# EAGLE design leitorEncoder (EAGLE 6.6.0)
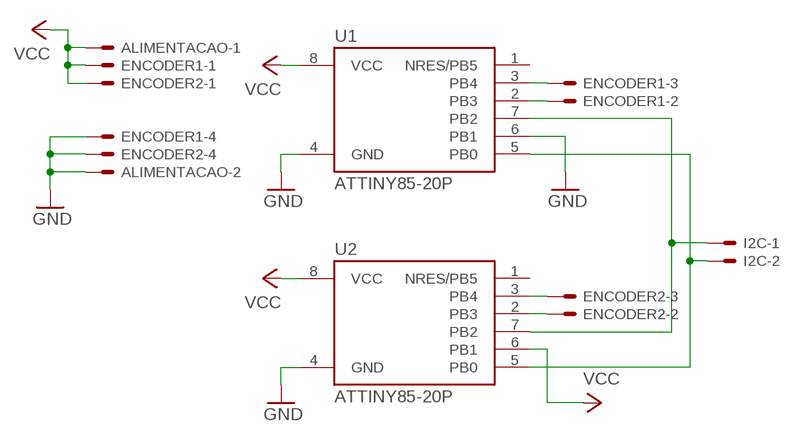
[diagram p0: schematic, sheet 1]

## Parts
ALIMENTACAO  CONN_0227-2021  [6410-02]
ENCODER1  CONN_0427-2041  [6410-04]
ENCODER2  CONN_0427-2041  [6410-04]
I2C  CONN_0227-2021  [6410-02]
U1  ATTINY85-20P  [PDIP08_300MIL]
U2  ATTINY85-20P  [PDIP08_300MIL]

## Nets
GND: ALIMENTACAO.2 ENCODER1.4 ENCODER2.4 U1.4(GND) U1.6(PB1) U2.4(GND)
N$1: I2C.2 U1.5(PB0) U2.5(PB0)
N$2: I2C.1 U1.7(PB2) U2.7(PB2)
N$3: ENCODER2.2 U2.2(PB3)
N$4: ENCODER1.3 U1.3(PB4)
N$5: ENCODER1.2 U1.2(PB3)
N$6: ENCODER2.3 U2.3(PB4)
VCC: ALIMENTACAO.1 ENCODER1.1 ENCODER2.1 U1.8(VCC) U2.6(PB1) U2.8(VCC)
Unconnected: U1.1(NRES/PB5) U2.1(NRES/PB5)

## Library data of the parts
ALIMENTACAO I2C = Robotica-IFRN-SC-conectores:CONN_02: CONNECTOR wire to board 2.54 mm (.1 inch) pitch header; OC_FARNELL: unknown; OC_NEWARK: unknown
ENCODER1 ENCODER2 = Robotica-IFRN-SC-conectores:CONN_04: CONNECTOR wire to board 2.54 mm (.1 inch) pitch header; OC_FARNELL: unknown; OC_NEWARK: unknown
U1 U2 = _hhn_attiny25_45_85:ATTINY85*: ATMEL ATtiny 85 Packages: P = PDIP 08 30mil S = SOIC 08 EIAJ 208mil Technologies Note: for complete ordering code (temp. range, finish, tape&reel etc.) see www.atmel.com • Supply Voltage: V = (1.8…5.5)V | [blank] = (2.7…5.5)V • Speed: 10 = 10 MHz | 20 = 20 MHz Author: Dipl.-Ing. FH Rainer Bayer HHN Hochschule Heilbronn (Heilbronn University), rainer.bayer@hs-heilbronn.de Ingenieurbüro ing-rb, mail@ing-rb.de

## Board
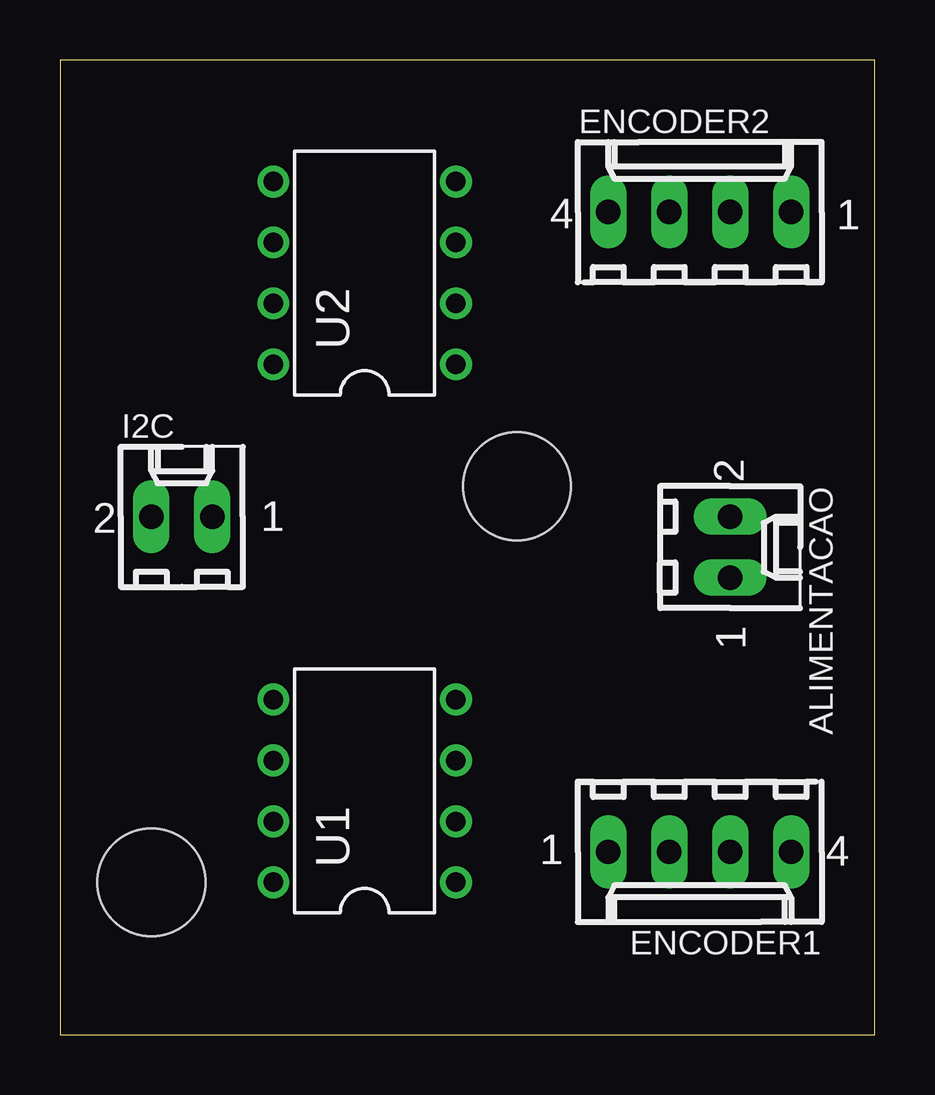
[diagram p1: board, top side]
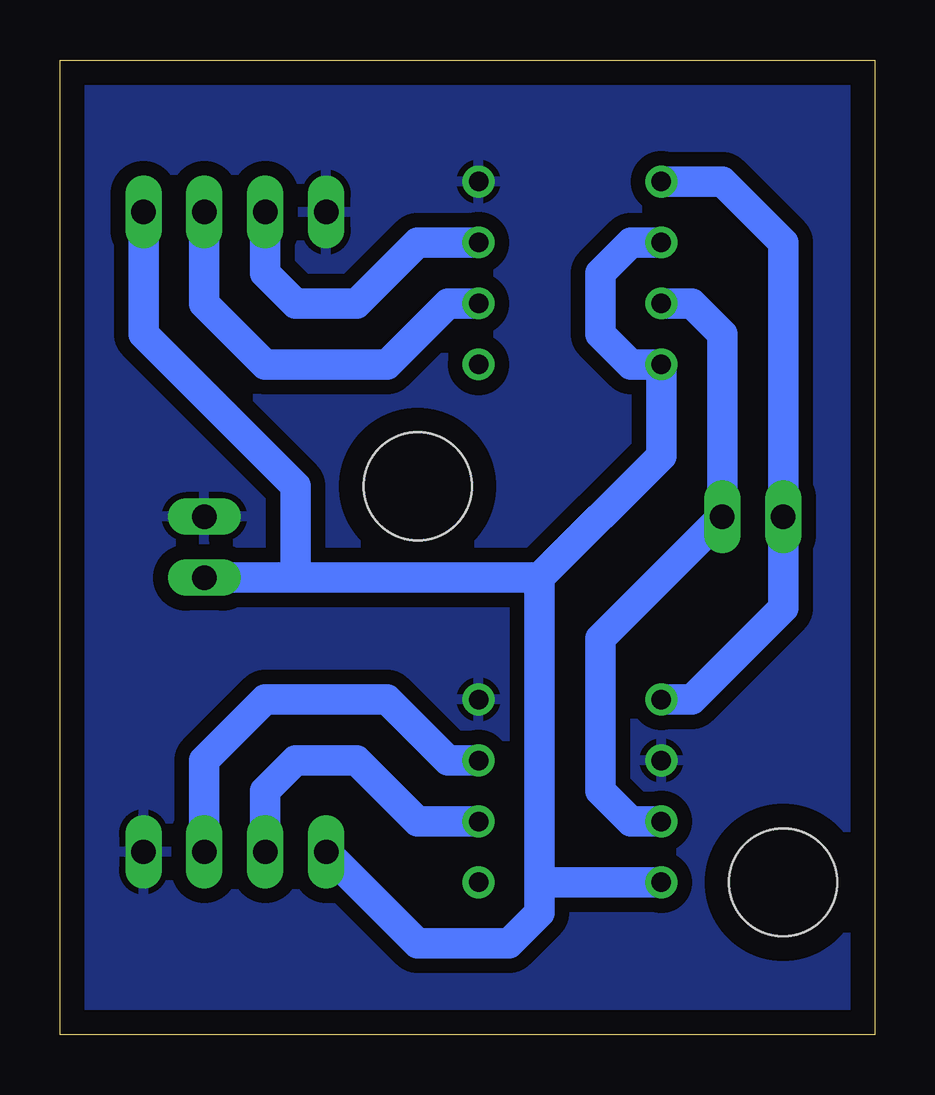
[diagram p2: board, bottom side, seen from below]

Size 33.96 x 40.63 mm. Coordinates in mm from the lower left corner, seen from the top.
Outline: 0,0 33.96,0 33.96,40.63 0,40.63 0,0
Copper layers (1*16): Top 0.035mm / dielectric 1.5mm / Bottom 0.035mm
Design rules "default *": minimum track width 50mil, minimum drill 24mil, track to track 24mil, track to pad 24mil, pad to pad 24mil, via to via 24mil, smd to smd 8mil, copper to edge 40mil, drill to drill 8mil, minimum pad ring 10mil, minimum via ring 8mil, stop-mask expansion 4mil, vias tented up to drill 0mil, thermal gap 10mil
Holes 4.5 mm at 19.05,22.86 3.81,6.35

### Footprints (pad centres in the part's own frame; a part is rotated, then mirrored left to right if it is on the bottom)
6410-02 = drill 1.016 long: 1 1.27,0; 2 -1.27,0
6410-04 = drill 1.016 long: 1 3.81,0; 2 1.27,0; 3 -1.27,0; 4 -3.81,0
PDIP08_300MIL = drill 0.813: 1 -3.81,-3.81; 2 -1.27,-3.81; 3 1.27,-3.81; 4 3.81,-3.81; 5 3.81,3.81; 6 1.27,3.81; 7 -1.27,3.81; 8 -3.81,3.81

### Placement (x,y rotation side)
ALIMENTACAO  27.94,20.32 270 top
ENCODER1  26.67,7.62 180 top
ENCODER2  26.67,34.29 0 top
I2C  5.08,21.59 0 top
U1  12.7,10.16 90 top
U2  12.7,31.75 90 top

### Tracks (layer width: path | path; a pad name or v marks a point on that pad's centre or on a via)
GND
  pour Bottom: -7.62,40.64 46.99,40.64 46.99,-5.08 -7.62,-5.08
N$1
  Bottom 1.27: U1.5 7.62,13.97 3.81,17.78 I2C.2 3.81,33.02 6.35,35.56 U2.5
N$2
  Bottom 1.27: U2.7 7.62,30.48 6.35,29.21 I2C.1 11.43,16.51 11.43,10.16 10.16,8.89 U1.7
N$3
  Bottom 1.27: U2.2 17.78,30.48 20.32,27.94 25.4,27.94 27.94,30.48 ENCODER2.2
N$4
  Bottom 1.27: ENCODER1.3 27.94,11.43 25.4,13.97 20.32,13.97 17.78,11.43 U1.3
N$5
  Bottom 1.27: ENCODER1.2 25.4,10.16 24.13,11.43 21.59,11.43 19.05,8.89 U1.2
N$6
  Bottom 1.27: ENCODER2.3 25.4,31.75 24.13,30.48 21.59,30.48 19.05,33.02 U2.3
VCC
  Bottom 1.27: ENCODER1.1 19.05,3.81 15.24,3.81 13.97,5.08 13.97,6.35 | 13.97,19.05 8.89,24.13 U2.8 10.16,27.94 11.43,29.21 11.43,31.75 10.16,33.02 U2.6 | 13.97,6.35 13.97,19.05 | U1.8 13.97,6.35 | ENCODER2.1 30.48,29.21 24.13,22.86 24.13,19.05 | ALIMENTACAO.1 24.13,19.05 | 24.13,19.05 13.97,19.05